# Altium schematic sheet Current Sensor.SchDoc: Hall Effect Current Sensor
size B; CheckedBy: Lance Bantoto; Engineer: Farris Matar; Revision: 2; SheetNumber: 1; SheetTotal: 1
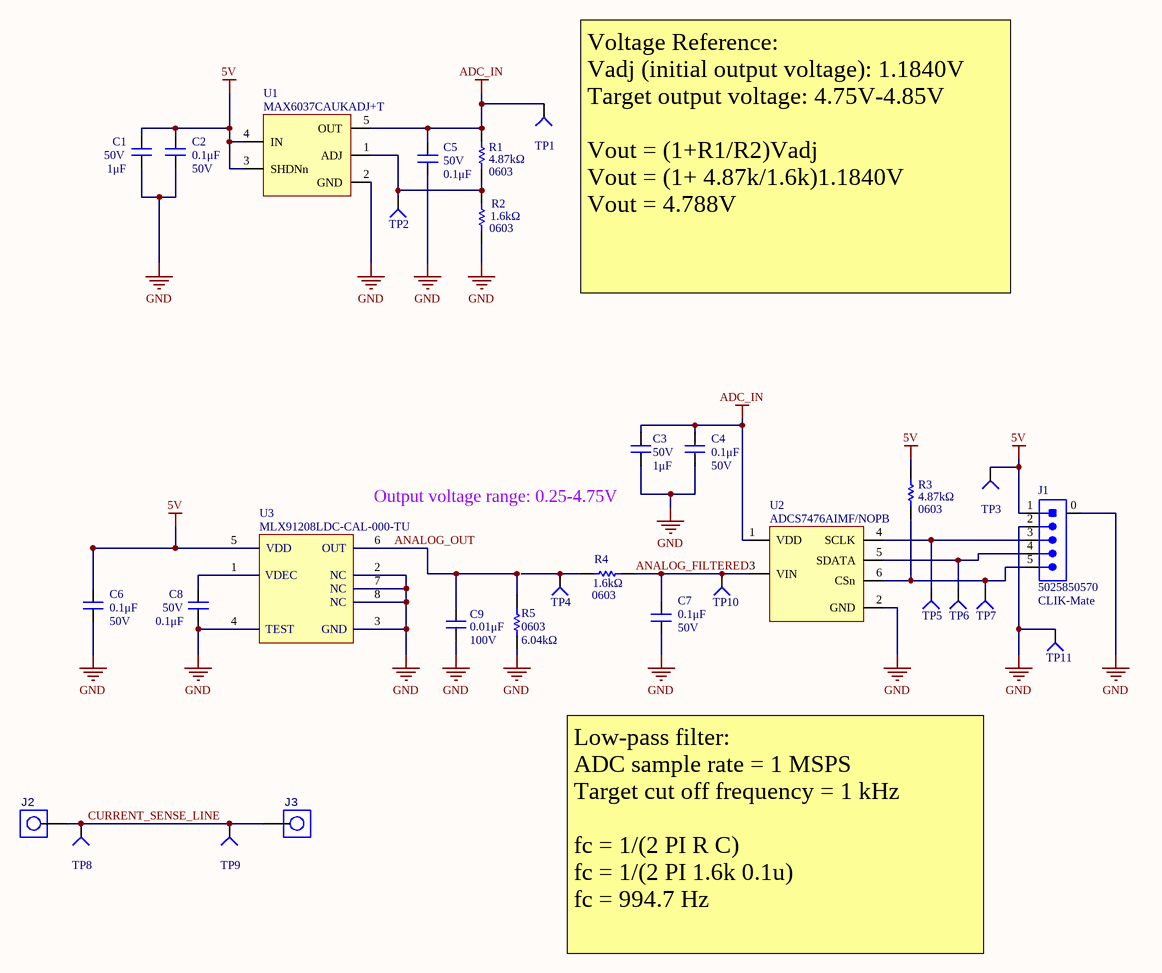
[diagram p0: Current Sensor.SchDoc]

## Parts
C1  value 1μF  Voltage Rating: 50V  [CAP0603]  (hidden comment: CAP_1uF_50V_0603)
C2  value 0.1μF  Voltage Rating: 50V  [CAP0603]  (hidden comment: CAP_0.1uF_50V_0603)
C3  value 1μF  Voltage Rating: 50V  [CAP0603]  (hidden comment: CAP_1uF_50V_0603)
C4  value 0.1μF  Voltage Rating: 50V  [CAP0603]  (hidden comment: CAP_0.1uF_50V_0603)
C5  value 0.1μF  Voltage Rating: 50V  [CAP0603]  (hidden comment: CAP_0.1uF_50V_0603)
C6  value 0.1μF  Voltage Rating: 50V  [CAP0603]  (hidden comment: CAP_0.1uF_50V_0603)
C7  value 0.1μF  Voltage Rating: 50V  [CAP0603]  (hidden comment: CAP_0.1uF_50V_0603)
C8  value 0.1μF  Voltage Rating: 50V  [CAP0603]  (hidden comment: CAP_0.1uF_50V_0603)
C9  value 0.01μF  Voltage Rating: 100V  [CAP0603]  (hidden comment: CAP_0.01uF_100V_0603)
J1  Manufacturer Part Number 1: 5025850570  Family: CLIK-Mate  [MOLEX-5025850570]  (hidden comment: CON_5M_SM_RA)
J2  SCREW_TERMINAL_1_POS_6_32  [7701_KEYSTONE]  (value not drawn)
J3  SCREW_TERMINAL_1_POS_6_32  [7701_KEYSTONE]  (value not drawn)
R1  value 4.87kΩ  [RES0603]  (hidden comment: RES_4.87kΩ_0603_1%)
R2  value 1.6kΩ  Package/Footprint: 0603  [RES0603]  (hidden comment: RES_1.6kΩ_0603_1%)
R3  value 4.87kΩ  [RES0603]  (hidden comment: RES_4.87kΩ_0603_1%)
R4  value 1.6kΩ  Package/Footprint: 0603  [RES0603]  (hidden comment: RES_1.6kΩ_0603_1%)
R5  value 6.04kΩ  Package/Footprint: 0603  [RES0603]  (hidden comment: RES_6.04kΩ_0603_1%)
TP1  TESTPOINT_SMD_LOOP  [S1751-46R]  (value not drawn)
TP2  TESTPOINT_1MM_CIRCLE  [TESTPOINT_CIRCLE_1MM]  (value not drawn)  (no BOM)
TP3  TESTPOINT_SMD_LOOP  [S1751-46R]  (value not drawn)
TP4  TESTPOINT_1MM_CIRCLE  [TESTPOINT_CIRCLE_1MM]  (value not drawn)  (no BOM)
TP5  TESTPOINT_1MM_CIRCLE  [TESTPOINT_CIRCLE_1MM]  (value not drawn)  (no BOM)
TP6  TESTPOINT_1MM_CIRCLE  [TESTPOINT_CIRCLE_1MM]  (value not drawn)  (no BOM)
TP7  TESTPOINT_1MM_CIRCLE  [TESTPOINT_CIRCLE_1MM]  (value not drawn)  (no BOM)
TP8  TESTPOINT_SMD_LOOP  [S1751-46R]  (value not drawn)
TP9  TESTPOINT_SMD_LOOP  [S1751-46R]  (value not drawn)
TP10  TESTPOINT_1MM_CIRCLE  [TESTPOINT_CIRCLE_1MM]  (value not drawn)  (no BOM)
TP11  TESTPOINT_1MM_SQUARE  [TESTPOINT_SQUARE_1MM]  (value not drawn)  (no BOM)
U1  MAX6037CAUKADJ+T  [SOT23-5]
U2  ADCS7476AIMF/NOPB  [ADCS747x]
U3  MLX91208LDC-CAL-000-TU  [8-SOIC_M]

## Nets
5V: C1.2 C2.2 C6.2 J1.1 R3.2 TP3.1(=value) U1.3(SHDNn) U1.4(IN) U3.5
ADC_IN: C3.2 C4.2 C5.2 R1.2 TP1.1(=value) U1.5(OUT) U2.1(VDD)
GND: C1.1 C2.1 C3.1 C4.1 C5.1 C6.1 C7.1 C8.1 C9.1 J1.0 J1.2 R2.1 R5.1 TP11.1(=value) U1.2(GND) U2.2(GND) U3.2 U3.3 U3.4 U3.7 U3.8
ANALOG_FILTERED: C7.2 R4.1 TP10.1(=value) U2.3(VIN)
ANALOG_OUT: C9.2 R5.2 U3.6
CURRENT_SENSE_LINE: J2.1 J3.1 TP8.1(=value) TP9.1(=value)
NetC8_2: C8.2 U3.1
NetJ1_3: J1.3 TP5.1(=value) U2.4(SCLK)
NetJ1_4: J1.4 TP6.1(=value) U2.5(SDATA)
NetJ1_5: J1.5 R3.1 TP7.1(=value) U2.6(CSn)
NetR1_1: R1.1 R2.2 TP2.1(=value) U1.1(ADJ)
NetR4_2: R4.2 TP4.1(=value)

## Notes on the sheet
- (near R1) 0603
- (near TP1) Voltage Reference:
  Vadj (initial output voltage): 1.1840V
  Target output voltage: 4.75V-4.85V
  Vout = (1+R1/R2)Vadj
  Vout = (1+ 4.87k/1.6k)1.1840V
  Vout = 4.788V
- Output voltage range: 0.25-4.75V
- (near R3) 0603
- Low-pass filter:
  ADC sample rate = 1 MSPS
  Target cut off frequency = 1 kHz
  fc = 1/(2 PI R C)
  fc = 1/(2 PI 1.6k 0.1u)
  fc = 994.7 Hz
- Title:
- Project:
- Date:
- Rev:
- Reviewer:
- Engineer:
- Sheet:
- of
- (in symbol MLX91208LDC-CAL-000-TU) VDD; OUT; VDEC; NC; TEST; GND

## Library data of the parts
C1 C3 = CAP_1uF_50V_0603: CAP CER 1UF 50V X6S 0603; Manufacturer Part Number 1: C1608X6S1H105K080AC; Manufacturer 1: TDK Corporation; Supplier 1: Digi-Key; Supplier Part Number 1: 445-7424-1-ND; Dielectric: X6S
C2 C4 C6-C8 = CAP_0.1uF_50V_0603: CAP CER 0.1UF 50V X7R 0603; Manufacturer 1: Yageo; Manufacturer Part Number 1: CC0603KRX7R9BB104; Package/Footprint: 0603; Dielectric: X7R; Supplier 1: Digi-Key; Supplier Part Number 1: 311-1344-1-ND; Mounting Type: SMD
C5 = CAP_0.1uF_50V_0603: CAP CER 0.1UF 50V X7R 0603; Manufacturer Part Number 1: CC0603KRX7R9BB104; Manufacturer 1: Yageo; Package/Footprint: 0603; Supplier Part Number 1: 311-1344-1-ND; Supplier 1: Digi-Key; Mounting Type: SMD; Dielectric: X7R
C9 = CAP_0.01uF_100V_0603: CAP CER 10000PF 100V X7R 0603; Manufacturer 1: Murata Electronics; Manufacturer Part Number 1: GCM188R72A103KA37J; Supplier 1: Digi-Key; Dielectric: X7R; Supplier Part Number 1: 490-8028-1-ND
J1 = CON_5M_SM_RA: CONN HEADER SMD RIGHT ANGLE 1.5MM PITCH; Manufacturer 1: Molex; Current Rating: 2A; Supplier 1: Digi-Key; Supplier Part Number 1: WM14469CT-ND; Orientation: Right Angle; Mounting Type: SMD; Package/Footprint: SMD
J2 J3 = SCREW_TERMINAL_1_POS_6_32: TERM W/ASSEMBLD SCREW VERT PCMNT; Manufacturer 1: Keystone Electronics; Manufacturer Part Number 1: 7701; Max Current Rating: 15A; Package/Footprint: TH; Supplier 1: Digi-Key; Supplier Part Number 1: 36-7701-ND; Mounting Type: TH
R1 R3 = RES_4.87kΩ_0603_1%: RES 4.87K OHM 1% 1/8W 0603; Manufacturer 1: Stackpole Electronics Inc; Manufacturer Part Number 1: RNCP0603FTD4K87; Package/Footprint: 0603; Supplier 1: Digi-Key; Supplier Part Number 1: RNCP0603FTD4K87CT-ND; Mounting Type: SMD
R2 R4 = RES_1.6kΩ_0603_1%: RES 1.6K OHM 1% 1/4W 0603; Manufacturer 1: Panasonic; Manufacturer Part Number 1: ERJ-PA3F1601V; Supplier 1: Digi-Key; Supplier Part Number 1: P1.6KBYCT-ND; Mounting Type: SMD
R5 = RES_6.04kΩ_0603_1%: RES 6.04K OHM 1% 1/10W 0603; Manufacturer 1: Panasonic Electronic Components; Manufacturer Part Number 1: ERJ-PB3D6041V; Supplier 1: Digi-Key; Supplier Part Number 1: P20372CT-ND; Mounting Type: SMD
TP1 TP3 TP8 TP9 = TESTPOINT_SMD_LOOP: PC TEST POINT SMD; Manufacturer 1: Harwin; Supplier 1: Digi-Key; Manufacturer Part Number 1: S1751-46R; Supplier Part Number 1: 952-1478-1-ND; Mounting Type: SMD; Package/Footprint: SMD
TP2 TP4-TP7 TP10 = TESTPOINT_1MM_CIRCLE: TESTPOINT 1MM CIRCLE; Part Number (MPN): *
TP11 = TESTPOINT_1MM_SQUARE: TESTPOINT 1MM SQUARE; Part Number (MPN): *
U1 = MAX6037CAUKADJ+T: IC VREF SERIES 5V 0.5% SOT23-5; Manufacturer 1: Maxim; Max Input Voltage: 6V; Max Output Current: 5mA; Reference Type: Series,Adjustable; Output Type: Adjustable; Min Output Voltage: 1.184V; Operating Supply Current: 250uA; Package/Footprint: SOT-23-5; Supplier 1: Digi-Key; RoHS: Yes; Category: Voltage References; Number of Pins: 5; Min Operating Temperature: -40°C; Max Operating Temperature: 125°C; Output Voltage: 5V; Max Output Voltage: 5V; Package Quantity: 2500; Tolerance: 0.5%; Quiescent Current: 250uA; Output Current: 5mA; Reference Voltage: 5V; Supplier Part Number 1: MAX6037CAUKADJ+TCT-ND; Manufacturer Part Number 1: MAX6037CAUKADJ+T; Mounting Type: SMD
U2 = ADCS7476AIMF/NOPB: IC ADC 12BIT SAR SOT23-6; Manufacturer 1: TI National Semiconductor; Sampling Rate: 1MS/s; Resolution: 12b; Polarity: Unipolar; Number of Analog Inputs: 1; Nominal Supply Current: 2mA; Interface: SPI,Serial; Max Supply Voltage: 5.25V; Min Supply Voltage: 2.7V; Operating Supply Voltage: 5V; Number of Bits: 12; Integral Nonlinearity (INL): -1.1LSB; Signal to Noise Ratio (SNR): 72.5dB; Power Consumption: 2mW; Conversion Rate: 1000KS/s; Package/Footprint: SOT-23-6; Supplier 1: Digi-Key; RoHS: Yes; Category: Analog to Digital Converters (ADCs); Stock 1: 18495; Pricing 1: 1=3.31000, 10=2.97500, 25=2.81240, 100=2.31250, 250=2.07500, 500=2.00000 (USD); Number of Pins: 6; Min Operating Temperature: -40°C; Max Operating Temperature: 125°C; Packaging: Tape and Reel; Number of Channels: 1; Number of Inputs: 1; Number of A/D Converters: 1; Number of Elements: 1; Package Quantity: 1000; Number of Converters: 1; Length: 2.92mm; Height: 1.02mm; Width: 1.6mm; Radiation Hardening: No; REACH SVHC: No SVHC; Lead Free: Lead Free; Supplier Part Number 1: ADCS7476AIMF/NOPBCT-ND; Manufacturer Part Number 1: ADCS7476AIMF/NOPB; Mounting Type: SMD
U3 = MLX91208LDC-CAL-000-TU: SENSOR CURRENT HALL 10MT AC/DC; Manufacturer 1: Melexis Technologies NV; Linearity: 0.75%; Accuracy: 0.1%; Frequency: 200kHz; Package/Footprint: 8-SOIC; Supplier 1: Digi-Key; Supplier Part Number 1: MLX91208LDC-CAL-000-TU-ND; Manufacturer Part Number 1: MLX91208LDC-CAL-000-TU; Mounting Type: SMD